# EasyEDA Pro project 后车mainboard_V2.1.epro

# Schematic mainboard_V2.1
Board Name: mainboard_V2.1; Create Date: 2025-02-20; Page Name: P1; Project Name: 主板（后车）; Schematic Name: mainboard_V2.1; Update Date: 2025-02-20; Company: 嘉立创EDA; Page Size: A4; Version: V1.0
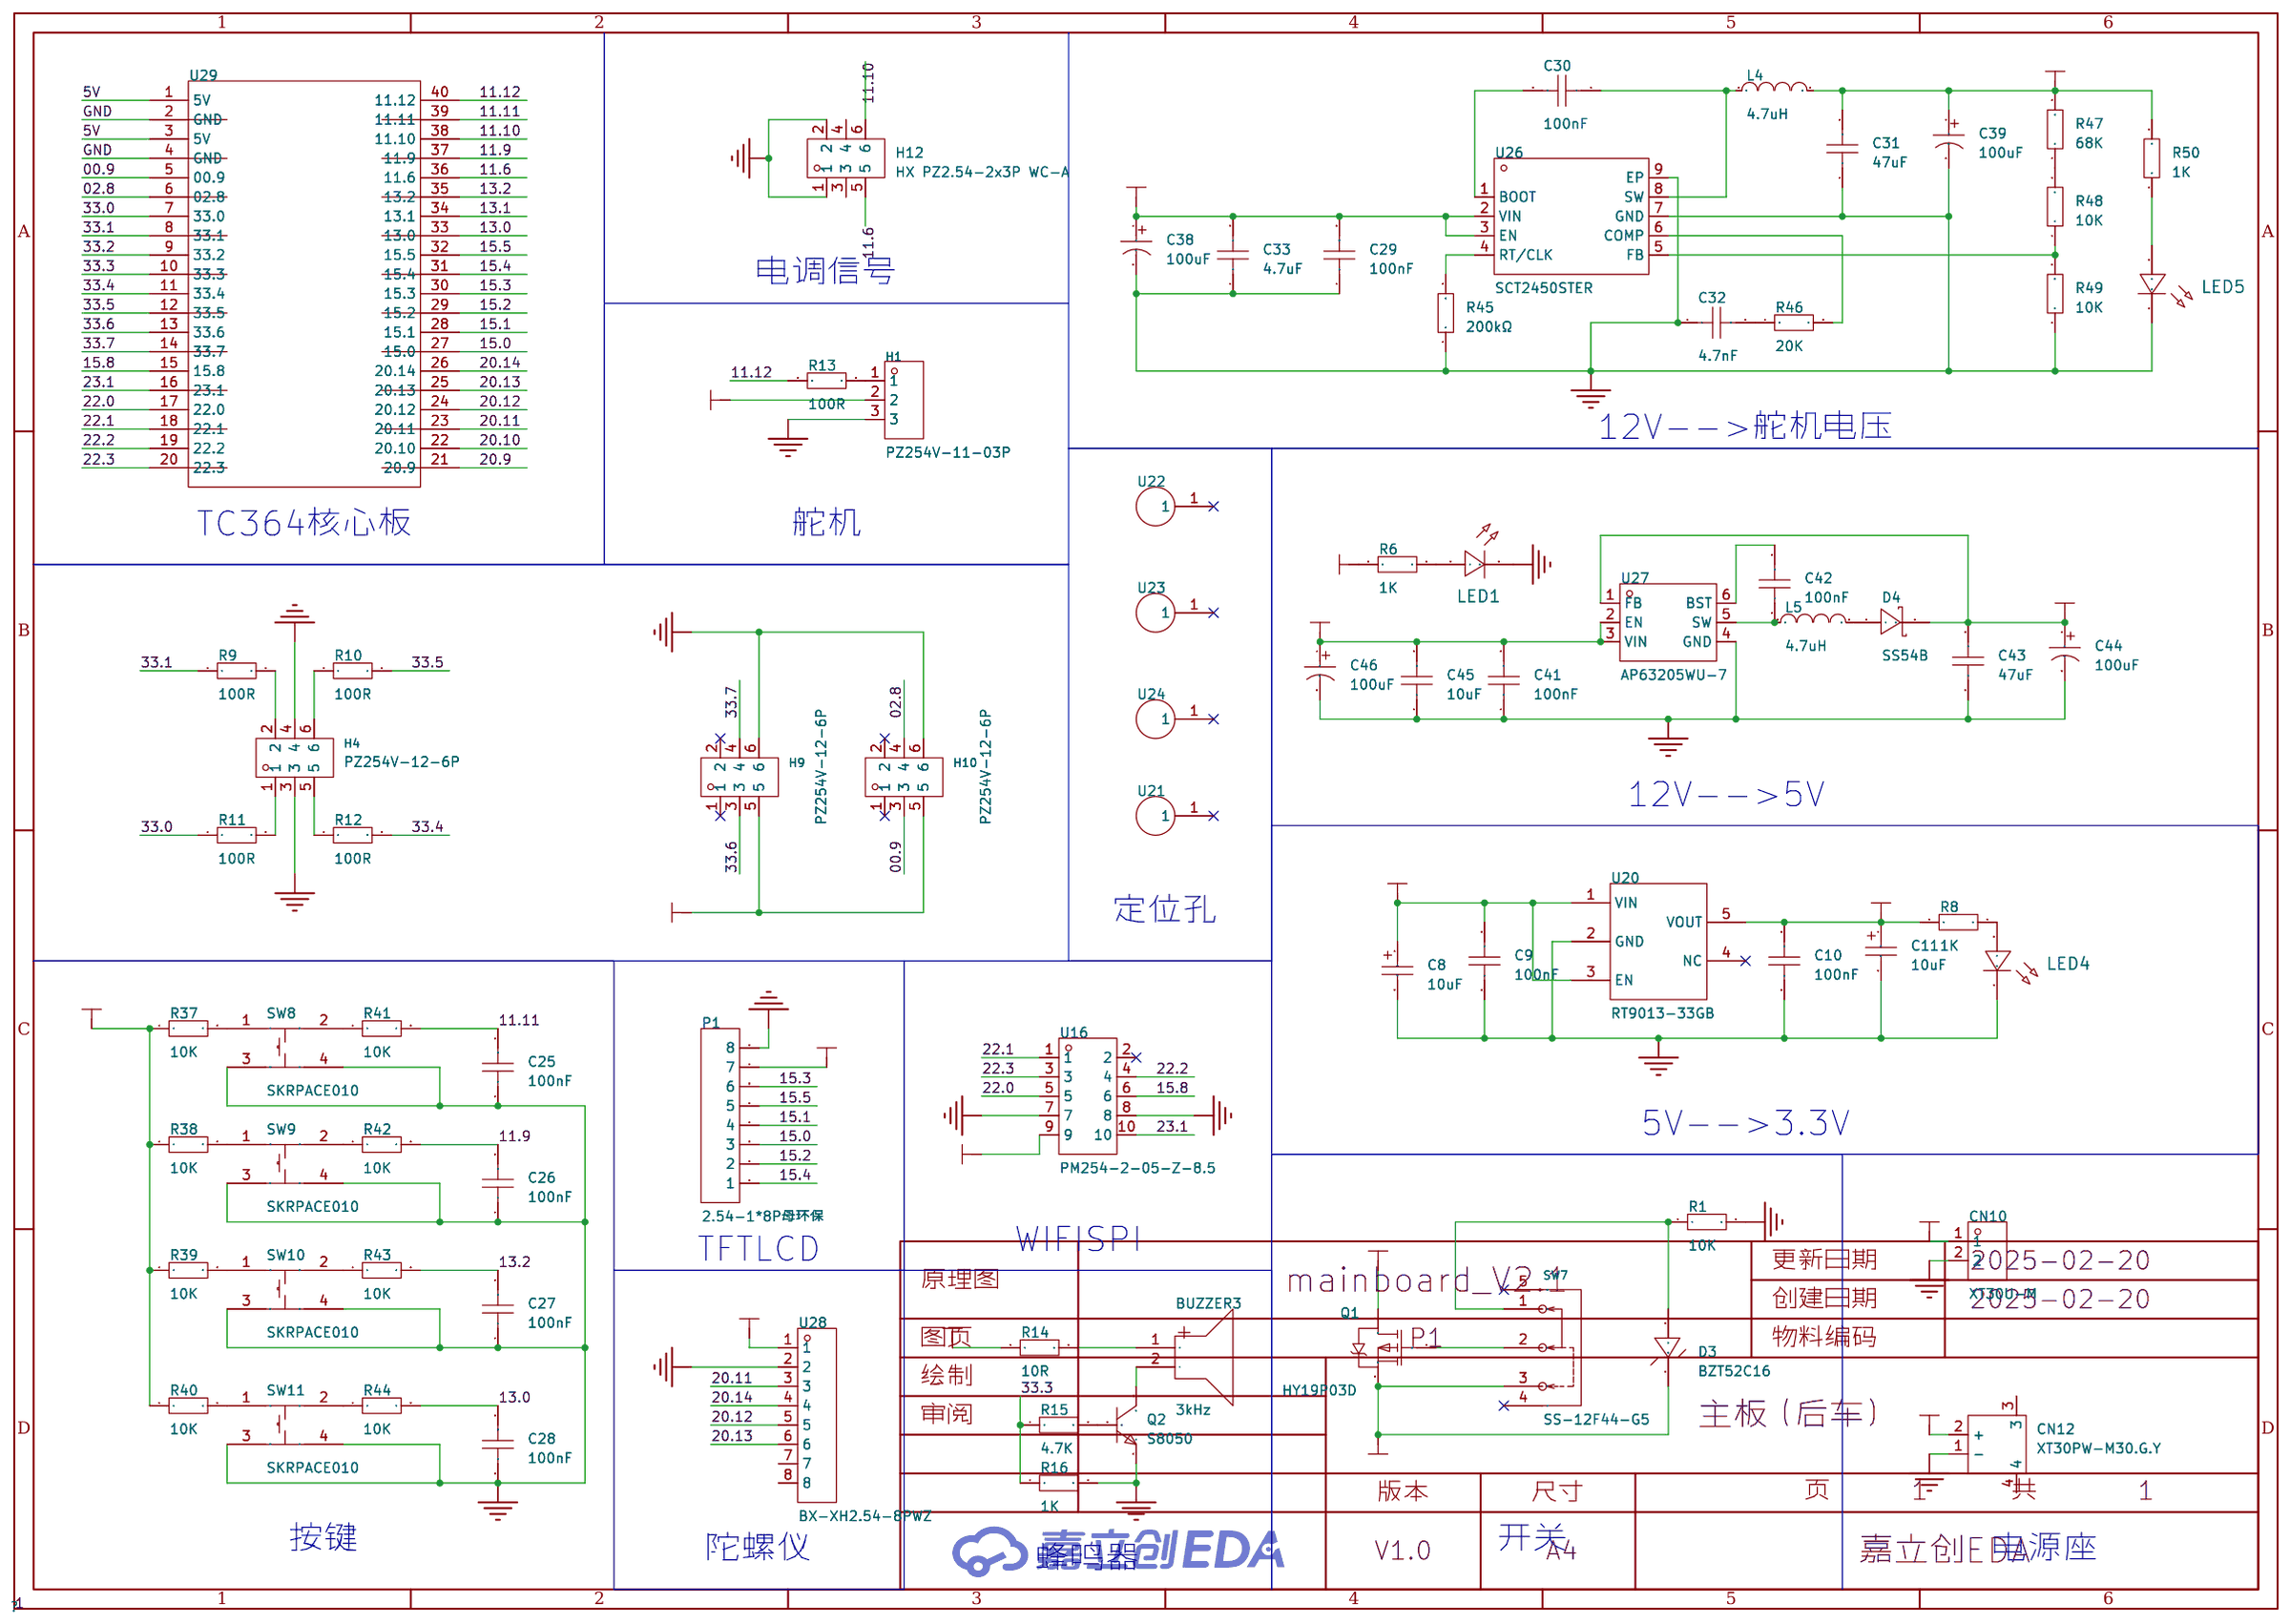
[diagram p0: schematic sheet]

## Parts
BUZZER3  3kHz  [BUZ-TH_BD9.0-P5.00-D0.6-FD]
C8  10uF  [CAP-SMD_L3.2-W1.6-RD-C7171]
C9  100nF  [C0603]
C10  100nF  [C0603]
C11  10uF  [CAP-SMD_L3.2-W1.6-RD-C7171]
C25  100nF  [C0603]
C26  100nF  [C0603]
C27  100nF  [C0603]
C28  100nF  [C0603]
C29  100nF  [C0603]
C30  100nF  [C0603]
C31  47uF  [C0805]
C32  4.7nF  [C0603]
C33  4.7uF  [C0603]
C38  100uF  [CAP-TH_BD6.3-P2.50-D1.0-FD]
C39  100uF  [CAP-TH_BD6.3-P2.50-D1.0-FD]
C41  100nF  [C0603]
C42  100nF  [C0603]
C43  47uF  [C0805]
C44  100uF  [CAP-TH_BD6.3-P2.50-D1.0-FD]
C45  10uF  [C0603]
C46  100uF  [CAP-TH_BD6.3-P2.50-D1.0-FD]
CN10  XT30U-M  [CONN-TH_XT30U-M]
CN12  XT30PW-M30.G.Y  [CONN-TH_XT30PW-M]
D3  BZT52C16  [SOD-123_L2.7-W1.6-LS3.7-RD]
D4  SS54B  [SMB_L4.6-W3.6-LS5.3-RD]
H1  PZ254V-11-03P  [HDR-TH_3P-P2.54-V-M]
H4  PZ254V-12-6P  [HDR-TH_6P-P2.54-V-M-R2-C3-S2.54]
H9  PZ254V-12-6P  [HDR-TH_6P-P2.54-V-M-R2-C3-S2.54]
H10  PZ254V-12-6P  [HDR-TH_6P-P2.54-V-M-R2-C3-S2.54]
H12  HX PZ2.54-2x3P WC-A  [HDR-TH_6P-P2.54-H-M-R2-C3-S2.54-W12.9]
L4  4.7uH  [IND-SMD_L7.0-W6.6]
L5  4.7uH  [IND-SMD_L7.0-W6.6]
LED1  -  [LED_0603]
LED4  -  [LED_0603]
LED5  -  [LED_0603]
P1  2.54-1*8P母环保  [HDR-TH_8P-P2.54-V-F-1]
Q1  HY19P03D  [TO-252-2_L6.6-W6.1-P4.57-LS9.9-TL-CW]
Q2  S8050  [SOT-23-3_L2.9-W1.3-P1.90-LS2.4-BR]
R1  10K  [R0603]
R6  1K  [R0603]
R8  1K  [R0603]
R9  100R  [R0603]
R10  100R  [R0603]
R11  100R  [R0603]
R12  100R  [R0603]
R13  100R  [R0603]
R14  10R  [R0603]
R15  4.7K  [R0603]
R16  1K  [R0603]
R37  10K  [R0603]
R38  10K  [R0603]
R39  10K  [R0603]
R40  10K  [R0603]
R41  10K  [R0603]
R42  10K  [R0603]
R43  10K  [R0603]
R44  10K  [R0603]
R45  200kΩ  [R0603]
R46  20K  [R0603]
R47  68K  [R0603]
R48  10K  [R0603]
R49  10K  [R0603]
R50  1K  [R0603]
SW7  SS-12F44-G5  [SW-TH_SS-12F44-G5]
SW8  SKRPACE010  [KEY-SMD_4P-L4.2-W3.2-P2.20-LS4.6]
SW9  SKRPACE010  [KEY-SMD_4P-L4.2-W3.2-P2.20-LS4.6]
SW10  SKRPACE010  [KEY-SMD_4P-L4.2-W3.2-P2.20-LS4.6]
SW11  SKRPACE010  [KEY-SMD_4P-L4.2-W3.2-P2.20-LS4.6]
U16  PM254-2-05-Z-8.5  [HDR-TH_10P-P2.54-V-F-R2-C5-S2.54]
U20  RT9013-33GB  [SOT-23-5_L3.0-W1.7-P0.95-LS2.8-BL]
U21  -  [M3螺丝孔]  (no BOM)
U22  -  [M3螺丝孔]  (no BOM)
U23  -  [M3螺丝孔]  (no BOM)
U24  -  [M3螺丝孔]  (no BOM)
U26  SCT2450STER  [ESOP-8_L4.9-W3.9-P1.27-LS6.0-BL-EP]
U27  AP63205WU-7  [TSOT-23-6_L2.9-W1.6-P0.95-LS2.8-BL]
U28  BX-XH2.54-8PWZ  [CONN-TH_8P-P2.50_BX-XH2.54-8PWZ]
U29  -  [TC364_CoreBoard_V3.0]

## Library data of the parts
BUZZER3 = HNB09A03: 驱动方式:有源(内含驱动线路);构造类型:电磁式;频率:3kHz;声压(SPL):85dB@10cm;; LCSC Part Name: 电磁式有源一体蜂鸣器HNB09A03; Supplier Part: C96102; Manufacturer: 华能; Supplier Footprint: 插件,D=9mm; JLCPCB Part Class: 扩展库; Datasheet: https://atta.szlcsc.com/upload/public/pdf/source/20170522/1495448326172.pdf; Supplier: LCSC; Oscillator Circuit: 有源(内含驱动线路); Technology Type: 电磁式; Operating Voltage: 1.5V~4.5V; Current Consumption: 30mA; Sound Pressure Level (SPL): 85dB@10cm; Diameter (φD): 9mm; Height: 5.5mm; Operating Temperature: -20℃~+70℃
C8 C11 = TAJA106K016RNJ: 容值:10uF;精度:±10%;额定电压:16V;等效串联电阻:3Ω@100kHz;; LCSC Part Name: 10uF ±10% 16V; Supplier Part: C7171; Manufacturer: Kyocera AVX; Supplier Footprint: CASE-A-3216; JLCPCB Part Class: 基础库; Datasheet: https://atta.szlcsc.com/upload/public/pdf/source/20160107/1457707750344.pdf; Supplier: LCSC; Tolerance: ±10%; Rated Voltage: 16V; Equivalent Series Resistance(ESR): 3Ω@100kHz; Operating Temperature: -55℃~+125℃
C9 C10 C29 C30 = CC0603KRX7R9BB104: 容值:100nF;精度:±10%;额定电压:50V;材质(温度系数):X7R;; LCSC Part Name: 100nF ±10% 50V; Supplier Part: C14663; Manufacturer: YAGEO(国巨); Supplier Footprint: 0603; JLCPCB Part Class: 基础库; Datasheet: https://atta.szlcsc.com/upload/public/pdf/source/20180910/C282072_33301C7F631E79921B82A8DAC6BCC5B3.pdf; Supplier: LCSC; Tolerance: ±10%; Voltage Rated: 50V; Temperature Coefficient: X7R
C25-C28 C32 C33 C41 C42 C45 = CAP_0603: Supplier Footprint: 0603
C31 C43 = CGA0805X5R476M100MT: 容值:47uF;精度:±20%;额定电压:10V;材质(温度系数):X5R;; LCSC Part Name: 47uF ±20% 10V; Supplier Part: C6119904; Manufacturer: HRE(芯声); Supplier Footprint: 0805; JLCPCB Part Class: 扩展库; Supplier: LCSC; Tolerance: ±20%; Voltage Rated: 10V; Temperature Coefficient: X5R
C38 C39 C44 C46 = SPZ1VM101E08O00RAXXX: 容值:100uF;精度:±20%;额定电压:35V;纹波电流:2.35A@100kHz;等效串联电阻:50mΩ@100kHz;类型:-;; LCSC Part Name: 100uF ±20% 35V; Supplier Part: C122240; Manufacturer: AISHI(艾华集团); Supplier Footprint: 插件,D6.3xL8mm; JLCPCB Part Class: 扩展库; Datasheet: https://atta.szlcsc.com/upload/public/pdf/source/20170721/C122240_1500619276730834029.pdf; Supplier: LCSC; Tolerance: ±20%; Rated Voltage: 35V; Ripple Current: 2.35A@100kHz; Equivalent Series Resistance(ESR): 50mΩ@100kHz; Lead Spacing: 2.5mm; φD: 6.3mm; L: 8mm; Lifetime @ Temp: 2000hrs@105℃; Operating Temperature: -55℃~+105℃
CN10 = XT30U-M: 类别:-;类型1:-;; LCSC Part Name: AMASS(艾迈斯)轻量版锂电池插头公头 XT30U-M; Supplier Part: C99101; Manufacturer: AMASS(艾迈斯); JLCPCB Part Class: 扩展库; Datasheet: https://atta.szlcsc.com/upload/public/pdf/source/20170606/1496716542582.pdf; Supplier: LCSC; Brand: 艾迈斯; Type: 插头; Colour: 黄色; InterfaceType: 公头
CN12 = XT30PW-M30.G.Y: 类别:-;类型1:-;; LCSC Part Name: AMASS(艾迈斯)航模插头 卧式弯脚 XT30PW-M公头; Supplier Part: C431092; Manufacturer: AMASS(艾迈斯); JLCPCB Part Class: Extended Part; Datasheet: https://atta.szlcsc.com/upload/public/pdf/source/20220222/6A9F22F7850E25B33E1BE430ADF8560B.pdf; Supplier: LCSC; Type: 航模插头; RatedVoltage: DC 500V; InterfaceType: 公头; RatedCurrent: 15A; RecommendedWireGauge: 16/18/20AWG; contact resistance: 1.2mΩ; specifications: 2pin
D3 = BZT52C16_C266570: 二极管配置:独立式;稳压值(标称值):16V;稳压值(范围):15.3V~17.1V;功率:500mW;精度:-;; Supplier Part: C266570; Manufacturer: BORN(伯恩半导体); Supplier Footprint: SOD-123; JLCPCB Part Class: 扩展库; Datasheet: https://atta.szlcsc.com/upload/public/pdf/source/20180820/C271262_D2D0F24DD5A81EAE2A6B8B493A94E64A.pdf; Supplier: LCSC; Diode Configuration: 独立式; Zener Voltage (Nom): 16V; Reverse Leakage Current (Ir): 100nA@11.2V; Zener Voltage (Range): 15.3V~17.1V; Power Dissipation: 500mW; Zener Impedance (Zzt): 40Ω
D4 = SS54B_C32513: 二极管配置:独立式;正向压降(Vf):550mV@5A;直流反向耐压(Vr):40V;整流电流:5A;; LCSC Part Name: 电压:40V 电流:5A; Supplier Part: C32513; Manufacturer: MDD(辰达半导体); Supplier Footprint: SMB(DO-214AA); JLCPCB Part Class: 扩展库; Datasheet: https://atta.szlcsc.com/upload/public/pdf/source/20240729/11D094B8AB06134CE012673FC230C171.pdf; Supplier: LCSC; Diode Configuration: 独立式; Forward Voltage (Vf@If): 550mV@5A; Reverse Voltage (Vr): 40V; Rectified Current: 5A; Reverse Leakage Current (Ir): 1mA@40V
H1 = PZ254V-11-03P: 排数:单排;总PIN位数:3;间距:2.54mm;插针结构:1x3P;行距:-;安装类型:直插;圆针/方针:方针;额定电流:3A;额定电压:250V;配合针长度:6mm;塑高:2.5mm;端接针长度:3mm;工作温度范围:-40℃~+105℃;颜色:黑色;; LCSC Part Name: 2.54mm 1x3P 直插 方针; Supplier Part: C2937625; Manufacturer: XFCN(兴飞); Supplier Footprint: 直插,P=2.54mm; JLCPCB Part Class: 扩展库; Datasheet: 2022-07-12/581362A/62b9d00620994b3696be7eb4af85ad72/双排排针和单排排针.pdf; Supplier: LCSC; Number of Rows: 单排; Number of Pins: 3; Pitch: 2.54mm; Pin Structure: 1x3P; Mounting Type: 直插; Circluar Pins/Square Pins: 方针; Current Rating (Max): 3A; Voltage Rating (Max): 250V; Length of Mating Pin: 6mm; Insulation Height: 2.5mm; Length of End Connection Pin: 3mm; Operating Temperature Range: -40℃~+105℃; Color: 黑色
H4 H9 H10 = PZ254V-12-6P: 排数:双排;总PIN位数:6P;间距:2.54mm;插针结构:2x3P;行距:2.54mm;安装类型:直插;圆针/方针:方针;额定电流:-;额定电压:-;配合针长度:6mm;塑高:2.5mm;端接针长度:3mm;触头材质:黄铜;触头镀层:-;工作温度范围:-40℃~+105℃;颜色:黑色;; LCSC Part Name: 2.54mm 2x3P 直插 方针; Supplier Part: C492420; Manufacturer: XFCN(兴飞); Supplier Footprint: 插件,P=2.54mm; JLCPCB Part Class: Extended Part; Datasheet: https://atta.szlcsc.com/upload/public/pdf/source/20200309/C492420_BAECB307B001054C09D200388220EAE6.pdf; Supplier: LCSC; Number of Rows: 双排; Number of Pins: 6P; Pitch: 2.54mm; Pin Structure: 2x3P; Row Spacing: 2.54mm; Mounting Type: 直插; Circluar Pins/Square Pins: 方针; Length of Mating Pin: 6mm; Insulation Height: 2.5mm; Length of End Connection Pin: 3mm; Contact Material: 黄铜; Operating Temperature Range: -40℃~+105℃; Color: 黑色
H12 = HX PZ2.54-2x3P WC-A: 插针结构:2x3P;间距:2.54mm;行距:2.54mm;圆针/方针:方针;安装类型:弯插;排数:双排;总PIN位数:6P;额定电流:3A;额定电压:-;配合针长度:6mm;塑高:2.5mm;端接针长度:3mm;触头镀层:金;工作温度范围:-40℃~+105℃;颜色:黑色;; LCSC Part Name: 2x3P 间距:2.54mm 方针 弯插; Supplier Part: C41417351; Manufacturer: hanxia(韩下); Supplier Footprint: 弯插,P=2.54mm; JLCPCB Part Class: 扩展库; Datasheet: https://atta.szlcsc.com/upload/public/pdf/source/20240927/53A3651CA0598B6B3668AB41F5C39B0F.pdf; Supplier: LCSC; Pin Structure: 2x3P; Pitch: 2.54mm; Row Spacing: 2.54mm; Circluar Pins/Square Pins: 方针; Mounting Type: 弯插; Number of Rows: 双排; Number of Pins: 6P; Current Rating (Max): 3A; Length of Mating Pin: 6mm; Insulation Height: 2.5mm; Length of End Connection Pin: 3mm; Contact Plating: 金; Operating Temperature Range: -40℃~+105℃; Color: 黑色
L4 L5 = FXL0630-4R7-M: 电感值:4.7uH;精度:±20%;额定电流:6A;饱和电流(Isat):9A;类型:一体成型电感;; LCSC Part Name: 4.7uH ±20% 9A; Supplier Part: C167220; Manufacturer: cjiang(长江微电); Supplier Footprint: SMD,6.6x7mm; JLCPCB Part Class: 扩展库; Datasheet: https://atta.szlcsc.com/upload/public/pdf/source/20240426/3189EA8206330E2108542F9E34E540E7.pdf; Supplier: LCSC; Tolerance: ±20%; Rated Current: 6A; Saturation Current (Isat): 9A; DC Resistance (DCR): 33mΩ; Type: 一体成型电感
LED1 LED4 LED5 = LED_0603-R: Supplier Footprint: 0603
P1 = 2.54-1*8P母环保: 插孔结构:1x8P;间距:2.54mm;行距:-;安装类型:直插;排数:单排;总孔位数:8P;塑高:-;触头材质:-;触头镀层:-;; LCSC Part Name: 间距:2.54mm 1x8P 直插; Supplier Part: C27438; Manufacturer: BOOMELE(博穆精密); Supplier Footprint: 插件,P=2.54mm; JLCPCB Part Class: Extended Part; Datasheet: https://atta.szlcsc.com/upload/public/pdf/source/20231221/1CA800C6799ED97958773716FAA1BFFE.pdf; Supplier: LCSC; Holes Structure: 1x8P; Pitch: 2.54mm; Mounting Type: 直插; Number of Rows: 单排; Number of Holes: 8P
Q1 = HY19P03D: 类型:P沟道;漏源电压(Vdss):30V;连续漏极电流(Id):90A;功率(Pd):50W;导通电阻(RDS(on)@Vgs,Id):6mΩ@10V,45A;阈值电压(Vgs(th)@Id):3V@250uA;; LCSC Part Name: P沟道 30V 90A; Supplier Part: C122492; Manufacturer: HUAYI(华羿微); Supplier Footprint: TO-252-2; JLCPCB Part Class: 扩展库; Datasheet: https://atta.szlcsc.com/upload/public/pdf/source/20170728/C122492_1501225751911848809.pdf; Supplier: LCSC; Type: P沟道; Drain Source Voltage (Vdss): 30V; Continuous Drain Current (Id): 90A; Power Dissipation (Pd): 50W; Drain Source On Resistance (RDS(on)@Vgs,Id): 6mΩ@10V,45A; Gate Threshold Voltage (Vgs(th)@Id): 3V@250uA
Q2 = S8050_C2891804: 晶体管类型:NPN;集电极电流(Ic):500mA;集射极击穿电压(Vceo):25V;功率(Pd):300mW;; LCSC Part Name: 耐压:25V 电流:500mA NPN; Supplier Part: C2891804; Manufacturer: YONGYUTAI(永裕泰); Supplier Footprint: SOT-23; JLCPCB Part Class: 扩展库; Datasheet: https://atta.szlcsc.com/upload/public/pdf/source/20210901/5347316A10609C628D4D69AE01446E5B.pdf; Supplier: LCSC; Transistor Type: NPN; Collector Current (Ic): 500mA; Collector-Emitter Breakdown Voltage (Vceo): 25V; Power Dissipation (Pd): 300mW; Collector Cut-Off Current (Icbo): 1uA; Collector-Emitter Saturation Voltage (VCE(sat)@Ic,Ib): 500mV@500mA,50mA; Operating Temperature: +150℃@(Tj)
R1 R6 R8-R16 R37-R44 R46-R50 = Res_0603: Supplier Footprint: 0603
R45 = 0603WAF2003T5E: 电阻类型:厚膜电阻;阻值:200kΩ;精度:±1%;功率:100mW;最大工作电压:75V;温度系数:±100ppm/℃;; LCSC Part Name: 200kΩ ±1% 100mW 厚膜电阻; Supplier Part: C25811; Manufacturer: UNI-ROYAL(厚声); Supplier Footprint: 0603; JLCPCB Part Class: 基础库; Datasheet: https://atta.szlcsc.com/upload/public/pdf/source/20200306/C422600_1E6D84923E4A46A82E41ADD87F860B5C.pdf; Supplier: LCSC; Type: 厚膜电阻; Tolerance: ±1%; Power(Watts): 100mW; Overload Voltage (Max): 75V; Temperature Coefficient: ±100ppm/℃; Operating Temperature Range: -55℃~+155℃
SW7 = SS-12F44-G5_C136718: 额定电流(DC):-;额定电压(DC):-;额定电流(AC):-;额定电压(AC):-;电路结构:单刀双掷;安装方式:直插;机械寿命:5千次;; LCSC Part Name: 直插双档 滑动开关; Supplier Part: C136718; Manufacturer: 韩国韩荣; Supplier Footprint: 插件; JLCPCB Part Class: 扩展库; Datasheet: https://atta.szlcsc.com/upload/public/pdf/source/20171123/C136718_15114108132111137440.pdf; Supplier: LCSC; Circuit: 单刀双掷; Mounting Style: 直插; Mechanical Life: 5千次; Actuator Style: 矩形柱状; Pin Style: PC引脚; Operating Temperature: -25℃~+70℃; Switch Height: 11mm
SW8-SW11 = SKRPACE010: 电路结构:单刀单掷;按钮形状:椭圆形按钮;安装方式:立贴;开关长度:4.2mm;开关宽度:3.2mm;开关高度:2.5mm;触点电流:50mA;额定电压(DC):16V;带灯:-;机械寿命:-;; LCSC Part Name: 4.2*3.2*2.5mm 立贴 轻触开关; Supplier Part: C139797; Manufacturer: ALPSALPINE(阿尔卑斯阿尔派); Supplier Footprint: SMD; JLCPCB Part Class: 扩展库; Datasheet: https://atta.szlcsc.com/upload/public/pdf/source/20171113/C139797_15105612676371115729.pdf; Supplier: LCSC; Circuit: 单刀单掷; Actuator Style: 椭圆形按钮; Mounting Style: 立贴; Switch Length: 4.2mm; Switch Width: 3.2mm; Switch Height: 2.5mm; Contact Current: 50mA; Voltage Rating (DC): 16V
U16 = PM254-2-05-Z-8.5: 排数:双排;总孔位数:10P;间距:2.54mm;插孔结构:2x5P;行距:2.54mm;安装类型:直插;圆孔/方孔:方孔;额定电流:3A;额定电压:-;插孔方向:顶部;塑高:8.5mm;工作温度范围:-40℃~+105℃;; LCSC Part Name: 间距:2.54mm 2x5P 直插; Supplier Part: C2897406; Manufacturer: HCTL(华灿天禄); Supplier Footprint: 插件,P=2.54mm; JLCPCB Part Class: 扩展库; Datasheet: https://atta.szlcsc.com/upload/public/pdf/source/20230609/3D36CA2C1BFC9FD1C3F709AD9DFEB9C2.pdf; Supplier: LCSC; Number of Rows: 双排; Number of Holes: 10P; Pitch: 2.54mm; Holes Structure: 2x5P; Row Spacing: 2.54mm; Mounting Type: 直插; Circular Hole / Square Hole: 方孔; Current Rating (Max): 3A; Holes Direction: 顶部; Insulation Height: 8.5mm; Operating Temperature Range: -40℃~+105℃
U20 = RT9013-33GB: 输出类型:固定;输出极性:正;最大输入电压:5.5V;输出电压:3.3V;输出电流:500mA;电源纹波抑制比(PSRR):50dB@(10kHz);; LCSC Part Name: 输入5.5V 输出3.3V 500mA; Supplier Part: C47773; Manufacturer: RICHTEK(立锜); Supplier Footprint: SOT-23-5; JLCPCB Part Class: 扩展库; Datasheet: https://atta.szlcsc.com/upload/public/pdf/source/20150504/1457707282459.pdf; Supplier: LCSC; Output Type: 固定; Output Polarity: 正; Number of Outputs: 1; Maximum Input Voltage: 5.5V; Output Voltage: 3.3V; Dropout Voltage: 400mV@(500mA); Quiescent Current (Ground Current): 50uA; Output Current: 500mA; Power Supply Rejection Ratio (PSRR): 50dB@(10kHz); Operating Temperature: -40℃~+85℃
U21-U24 = M3螺丝孔
U26 = SCT2450STER: LCSC Part Name: 电源IC; Supplier Part: C509400; Manufacturer: SCT(芯洲科技); Supplier Footprint: ESOP-8; JLCPCB Part Class: 扩展库; Datasheet: https://atta.szlcsc.com/upload/public/pdf/source/20200407/C509400_EDF779A672A59398CFBA9E95FA584FEC.pdf; Supplier: LCSC
U27 = AP63205WU-7: 功能类型:降压型;输出类型:固定;输入电压:3.8V~32V;输出电压:5V;输出电流:2A;; LCSC Part Name: 3.8V至32V输入、2A低静态电流同步降压转换器，增强EMI抑制; Supplier Part: C2071056; Manufacturer: DIODES(美台); Supplier Footprint: TSOT-23-6; JLCPCB Part Class: 扩展库; Datasheet: https://atta.szlcsc.com/upload/public/pdf/source/20210622/C780769_099C67289BD3EC61AAFB52D8B07125B3.pdf; Supplier: LCSC; Function: 降压型; Output Type: 固定; Input Voltage: 3.8V~32V; Output Voltage: 5V; Output Current: 2A; Switching Frequency: 1.1MHz; Operating Temperature: -40℃~+85℃@(TA); Synchronous Rectification: 是; Number of Outputs: 1; Topology: 降压式; Quiescent Current (Iq): 22uA; Switch tube (built-in/external): 内置
U28 = BX-XH2.54-8PWZ: 插针结构:1x8P;间距:2.54mm;安装方式:弯插;参考系列:XH;总PIN数:8P;排数:1;每排PIN数:8;行距:-;额定电流:3A;触头材质:黄铜;触头镀层:锡;工作温度范围:-25℃~+85℃;; LCSC Part Name: 配套胶壳型号：BX-XH2.54-8PJK 配套端子型号：BX-XH2.54-DZ 配套杜邦线型号：BX-XH2.54-8PBXC; Supplier Part: C18077848; Manufacturer: Bossie(博锡); Supplier Footprint: 弯插,P=2.54mm; JLCPCB Part Class: 扩展库; Datasheet: https://atta.szlcsc.com/upload/public/pdf/source/20231017/41AC97E47A986FC17CA1415D1E63C8BA.pdf; Supplier: LCSC; Pins Structure: 1x8P; Pitch: 2.54mm; Mounting Style: 弯插; Reference Series: XH; Number of Pins: 8P; Number of Rows: 1; Number of PINs Per Row: 8; Current Rating (Max): 3A; Contact Material: 黄铜; Contact Plating: 锡; Operating Temperature Range: -25℃~+85℃
U29 = TC364_CoreBoard_V3.0

## Nets
3V3: C10.2 C11.1 H9.5 H10.5 P1.7 R8.2 R14.1 R37.1 R38.1 R39.1 R40.1 U20.5(VOUT) U28.1
5V: C8.1 C9.2 C43.2 C44.1 D4.1(K) R6.2 U16.9 U20.1(VIN) U20.3(EN) U27.1(FB) U29.1(5V) U29.3(5V)
GND: C8.2 C9.1 C10.1 C11.2 C25.1 C26.1 C27.1 C28.1 C29.1 C31.1 C32.1 C33.1 C38.2 C39.2 C41.1 C43.1 C44.2 C45.1 C46.2 CN10.2 CN12.1(-) H1.3 H4.3 H4.4 H9.6 H10.6 H12.1 H12.2 LED1.1(C) LED4.1(C) LED5.1(C) P1.8 Q2.2(E) R1.2 R16.2 R45.1 R49.1 SW8.3 SW8.4 SW9.3 SW9.4 SW10.3 SW10.4 SW11.3 SW11.4 U16.7 U16.8 U20.2(GND) U26.7(GND) U26.9(EP) U27.4(GND) U28.2 U29.2(GND) U29.4(GND)
VCCBAT: C29.2 C33.2 C38.1 C41.2 C45.2 C46.1 CN12.2(+) Q1.2(D) U26.2(VIN) U26.3(EN) U27.2(EN) U27.3(VIN)
VCCSTEER: C31.2 C39.1 H1.2 L4.2 R47.2 R50.2
VIN: CN10.1 D3.1 Q1.3(S) SW7.3
00.9: H10.3 U29.5(00.9)
02.8: H10.4 U29.6(02.8)
11.6: H12.5 U29.36(11.6)
11.9: C26.2 R42.2 U29.37(11.9)
11.10: H12.6 U29.38(11.10)
11.11: C25.2 R41.2 U29.39(11.11)
11.12: R13.1 U29.40(11.12)
13.0: C28.2 R44.2 U29.33(13.0)
13.1: U29.34(13.1)
13.2: C27.2 R43.2 U29.35(13.2)
15.0: P1.3 U29.27(15.0)
15.1: P1.4 U29.28(15.1)
15.2: P1.2 U29.29(15.2)
15.3: P1.6 U29.30(15.3)
15.4: P1.1 U29.31(15.4)
15.5: P1.5 U29.32(15.5)
15.8: U16.6 U29.15(15.8)
20.9: U29.21(20.9)
20.10: U29.22(20.10)
20.11: U28.3 U29.23(20.11)
20.12: U28.5 U29.24(20.12)
20.13: U28.6 U29.25(20.13)
20.14: U28.4 U29.26(20.14)
22.0: U16.5 U29.17(22.0)
22.1: U16.1 U29.18(22.1)
22.2: U16.4 U29.19(22.2)
22.3: U16.3 U29.20(22.3)
23.1: U16.10 U29.16(23.1)
33.0: R11.1 U29.7(33.0)
33.1: R9.1 U29.8(33.1)
33.2: U29.9(33.2)
33.3: R15.1 R16.1 U29.10(33.3)
33.4: R12.2 U29.11(33.4)
33.5: R10.2 U29.12(33.5)
33.6: H9.3 U29.13(33.6)
33.7: H9.4 U29.14(33.7)
$1N756: Q1.1(G) SW7.2
$1N757: D3.2 R1.1 SW7.1
$1N1651: LED1.2(A) R6.1
$1N1936: LED4.2(A) R8.1
$1N2039: H1.1 R13.2
$1N2442: BUZZER3.1(+) R14.2
$1N2446: BUZZER3.2(-) Q2.3(C)
$1N2966: H4.2 R9.2
$1N2968: H4.6 R10.1
$1N2969: H4.1 R11.2
$1N2971: H4.5 R12.1
$1N3489: R37.2 SW8.1
$1N3490: R38.2 SW9.1
$1N3491: R39.2 SW10.1
$1N3492: R40.2 SW11.1
$1N3494: R42.1 SW9.2
$1N3495: R43.1 SW10.2
$1N3496: R44.1 SW11.2
$1N3497: R41.1 SW8.2
$1N3677: Q2.1(B) R15.2
$1N6375: R45.2 U26.4(RT/CLK)
$1N6376: C30.2 U26.1(BOOT)
$1N6377: C30.1 L4.1 U26.8(SW)
$1N6378: R48.1 R49.2 U26.5(FB)
$1N6381: LED5.2(A) R50.1
$1N6382: R46.2 U26.6(COMP)
$1N6384: C32.2 R46.1
$1N6385: R47.1 R48.2
$1N16876: C42.1 L5.1 U27.5(SW)
$1N16880: C42.2 U27.6(BST)
$1N18849: D4.2(A) L5.2

Not connected (* = marked no-connect by the designer): CN12 3 4; H9 1* 2*; H10 1* 2*; H12 3 4; SW7 4* 5*; U16 2*; U20 4(NC)*; U21 1*; U22 1*; U23 1*; U24 1*; U28 7 8

## Notes on the sheet
- 电调信号
- 12V-->舵机电压
- TC364核心板
- 舵机
- 12V-->5V
- 定位孔
- 5V-->3.3V
- TFTLCD
- WIFISPI
- 按键
- 陀螺仪
- 开关
- 电源座
- 蜂鸣器

# Board mainboard_V2.1
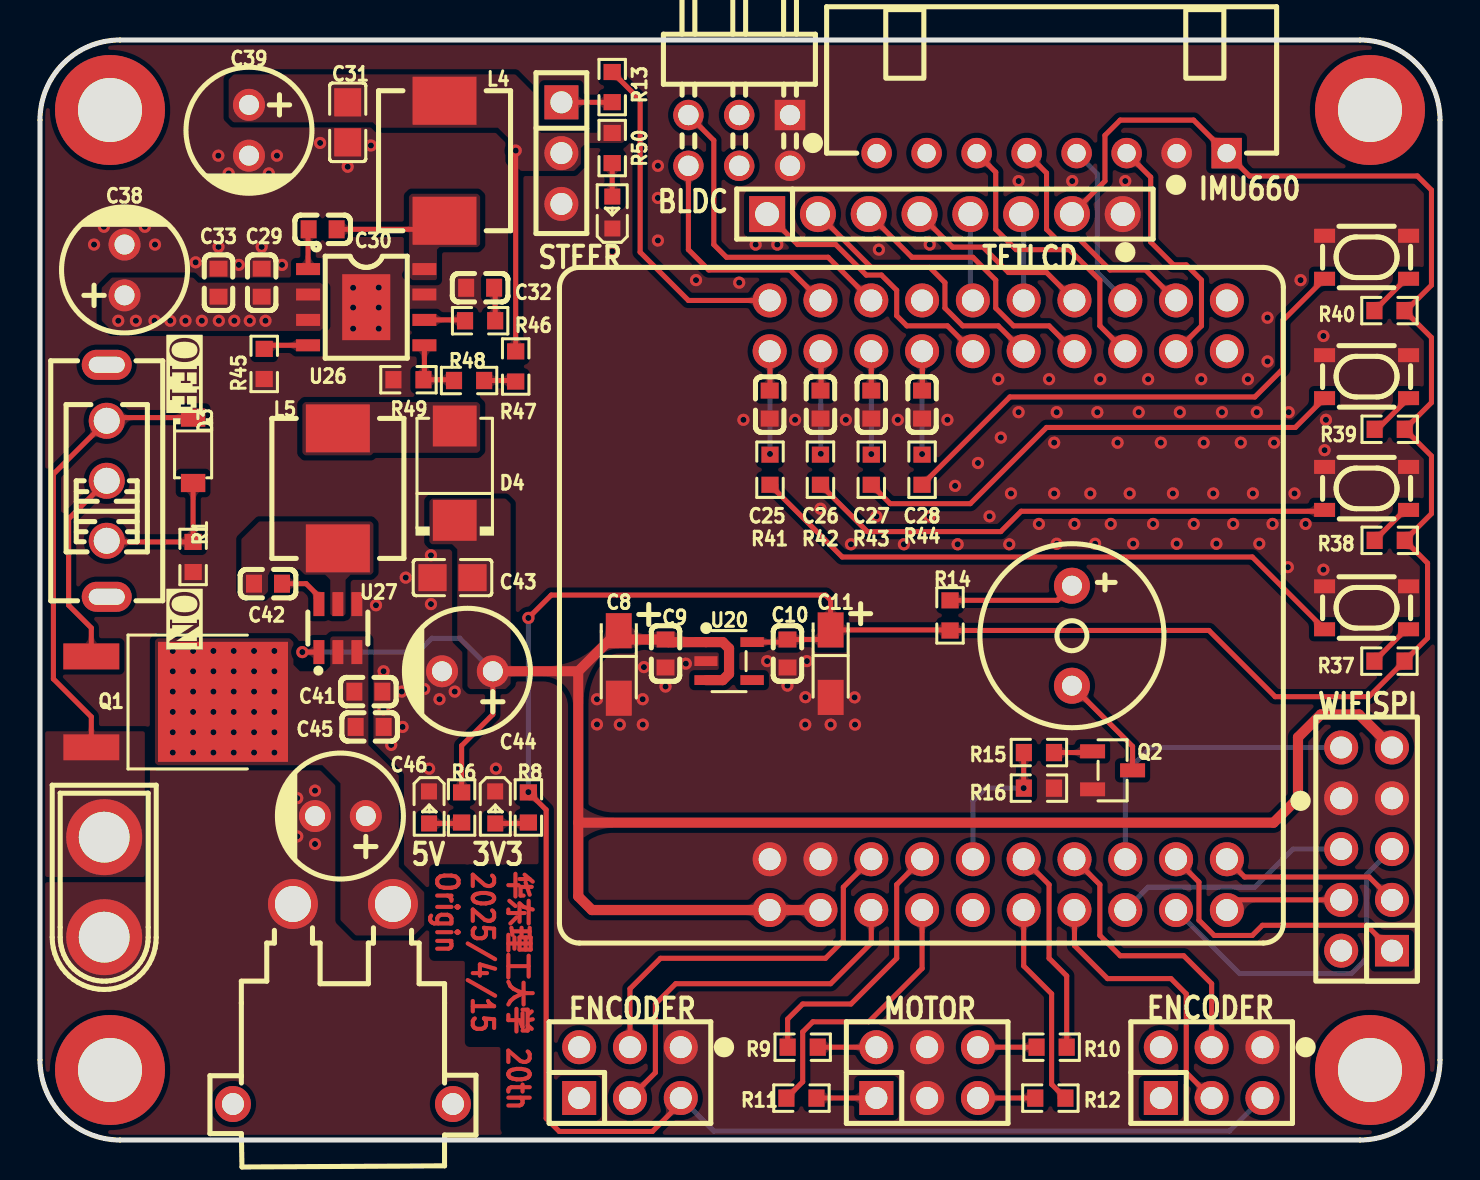
[diagram p1: board, top side]
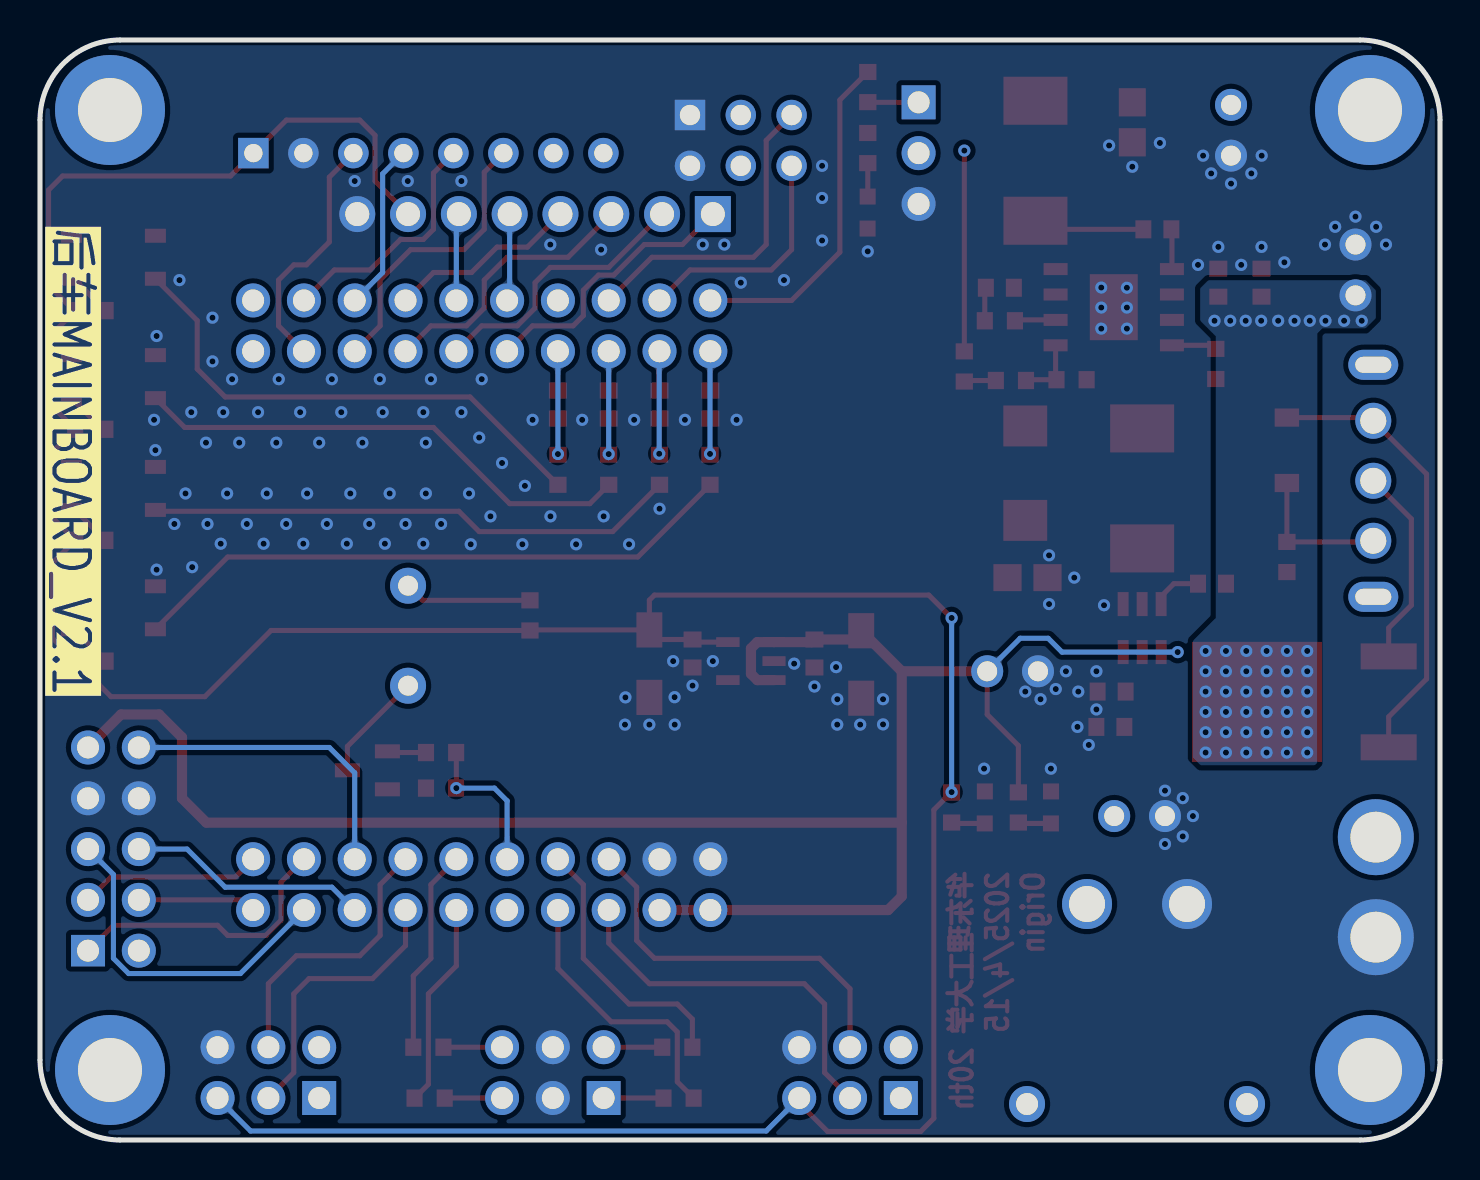
[diagram p2: board, bottom side, seen from below]

Outline 70 x 55 mm; copper layers: Top Layer, Bottom Layer. Coordinates in mm from the lower left corner of the outline.
Outline path: 0,51 0,4 arc(1.17,1.17) 4,0 66,0 arc(68.83,1.17) 70,4 70,51 arc(68.83,53.83) 66,55 4,55 arc(1.17,53.83) 0,51
Stack: Top Layer 0.035mm / Dielectric1 1.51mm FR4 er 4.5 / Bottom Layer 0.035mm

## Design rules (mm)
template: 4层
spacing copperThickness1oz (default): track to track 0.102, other pairs 0.152 to 0.3
spacing copperThickness2oz: track to track 0.203, other pairs 0.152 to 0.3
spacing copperThicknessInner0.5oz: track to track 0.089, other pairs 0.152 to 0.3
track width copperThickness1oz (default): min 0.102, default 0.254, max 2.54
track width copperThickness2oz: min 0.203, default 0.254, max 2.54
track width copperThickness0.5oz: min 0.089, default 0.254, max 2.54
differential pair differentialPair (default): width min 0.127, default 0.254, max 2.54; gap min 0.152, default 0.152
via viaSize (default): diameter min 0.3, default 0.61, max 10; hole min 0.2, default 0.305, max 6.3

## Placement (name value [footprint] x y rotation side)
BUZZER3  3kHz  [BUZ-TH_BD9.0-P5.00-D0.6-FD]  51.6 25.21 270 top
C8  10uF  [CAP-SMD_L3.2-W1.6-RD-C7171]  28.94 23.78 270 top
C9  100nF  [C0603]  31.28 24.33 90 top
C10  100nF  [C0603]  37.37 24.33 90 top
C11  10uF  [CAP-SMD_L3.2-W1.6-RD-C7171]  39.53 23.82 270 top
C25  100nF  [C0603]  36.48 36.77 90 top
C26  100nF  [C0603]  39.02 36.77 90 top
C27  100nF  [C0603]  41.56 36.77 90 top
C28  100nF  [C0603]  44.1 36.77 90 top
C29  100nF  [C0603]  11.08 42.87 270 top
C30  100nF  [C0603]  14.13 45.53 180 top
C31  47uF  [C0805]  15.39 50.88 90 top
C32  4.7nF  [C0603]  22.01 42.61 0 top
C33  4.7uF  [C0603]  8.92 42.87 270 top
C38  100uF  [CAP-TH_BD6.3-P2.50-D1.0-FD]  4.23 43.5 90 top
C39  100uF  [CAP-TH_BD6.3-P2.50-D1.0-FD]  10.45 50.49 270 top
C41  100nF  [C0603]  16.42 22.42 180 top
C42  100nF  [C0603]  11.4 27.82 0 top
C43  47uF  [C0805]  20.62 28.12 0 top
C44  100uF  [CAP-TH_BD6.3-P2.50-D1.0-FD]  21.37 23.44 180 top
C45  10uF  [C0603]  16.48 20.65 180 top
C46  100uF  [CAP-TH_BD6.3-P2.50-D1.0-FD]  15.02 16.2 180 top
CN10  XT30U-M  [CONN-TH_XT30U-M]  3.21 12.64 270 top
CN12  XT30PW-M30.G.Y  [CONN-TH_XT30PW-M]  15.15 6.8 0 top
D3  BZT52C16  [SOD-123_L2.7-W1.6-LS3.7-RD]  7.66 34.48 270 top
D4  SS54B  [SMB_L4.6-W3.6-LS5.3-RD]  20.74 33.34 90 top
H1  PZ254V-11-03P  [HDR-TH_3P-P2.54-V-M]  26.07 49.34 270 top
H4  PZ254V-12-6P  [HDR-TH_6P-P2.54-V-M-R2-C3-S2.54]  44.36 3.37 0 top
H9  PZ254V-12-6P  [HDR-TH_6P-P2.54-V-M-R2-C3-S2.54]  58.58 3.37 0 top
H10  PZ254V-12-6P  [HDR-TH_6P-P2.54-V-M-R2-C3-S2.54]  29.5 3.37 0 top
H12  HX PZ2.54-2x3P WC-A  [HDR-TH_6P-P2.54-H-M-R2-C3-S2.54-W12.9]  34.96 49.98 180 top
L4  4.7uH  [IND-SMD_L7.0-W6.6]  20.23 48.96 90 top
L5  4.7uH  [IND-SMD_L7.0-W6.6]  14.89 32.58 90 top
LED1  -  [LED_0603]  19.46 16.58 270 top
LED4  -  [LED_0603]  22.77 16.58 270 top
LED5  -  [LED_0603]  28.61 46.42 90 top
P1  2.54-1*8P母环保  [HDR-TH_8P-P2.54-V-F-1]  45.25 46.3 0 top
Q1  HY19P03D  [TO-252-2_L6.6-W6.1-P4.57-LS9.9-TL-CW]  5.86 21.91 0 top
Q2  S8050  [SOT-23-3_L2.9-W1.3-P1.90-LS2.4-BR]  53.63 18.48 180 top
R1  10K  [R0603]  7.66 29.15 270 top
R6  1K  [R0603]  21.08 16.63 90 top
R8  1K  [R0603]  24.42 16.63 90 top
R9  100R  [R0603]  38.13 4.64 0 top
R10  100R  [R0603]  50.58 4.64 0 top
R11  100R  [R0603]  38.07 2.09 0 top
R12  100R  [R0603]  50.52 2.09 0 top
R13  100R  [R0603]  28.61 52.65 270 top
R14  10R  [R0603]  45.5 26.23 90 top
R15  4.7K  [R0603]  49.95 19.37 0 top
R16  1K  [R0603]  49.95 17.59 0 top
R37  10K  [R0603]  67.47 23.94 180 top
R38  10K  [R0603]  67.49 29.98 180 top
R39  10K  [R0603]  67.49 35.54 180 top
R40  10K  [R0603]  67.47 41.47 180 top
R41  10K  [R0603]  36.5 33.51 90 top
R42  10K  [R0603]  39.02 33.51 90 top
R43  10K  [R0603]  41.56 33.51 90 top
R44  10K  [R0603]  44.1 33.51 90 top
R45  200kΩ  [R0603]  11.21 38.8 90 top
R46  20K  [R0603]  22.01 40.96 180 top
R47  68K  [R0603]  23.78 38.68 90 top
R48  10K  [R0603]  21.45 37.97 0 top
R49  10K  [R0603]  18.42 38.01 0 top
R50  1K  [R0603]  28.61 49.6 90 top
SW7  SS-12F44-G5  [SW-TH_SS-12F44-G5]  3.34 32.96 90 top
SW8  SKRPACE010  [KEY-SMD_4P-L4.2-W3.2-P2.20-LS4.6]  66.33 26.61 180 top
SW9  SKRPACE010  [KEY-SMD_4P-L4.2-W3.2-P2.20-LS4.6]  66.33 32.58 180 top
SW10  SKRPACE010  [KEY-SMD_4P-L4.2-W3.2-P2.20-LS4.6]  66.33 38.17 180 top
SW11  SKRPACE010  [KEY-SMD_4P-L4.2-W3.2-P2.20-LS4.6]  66.33 44.14 180 top
U16  PM254-2-05-Z-8.5  [HDR-TH_10P-P2.54-V-F-R2-C5-S2.54]  66.33 14.55 90 top
U20  RT9013-33GB  [SOT-23-5_L3.0-W1.7-P0.95-LS2.8-BL]  34.45 23.94 270 top
U21  -  [M3螺丝孔]  66.5 51.5 0 top
U22  -  [M3螺丝孔]  3.5 3.5 0 top
U23  -  [M3螺丝孔]  3.5 51.5 0 top
U24  -  [M3螺丝孔]  66.5 3.5 0 top
U26  SCT2450STER  [ESOP-8_L4.9-W3.9-P1.27-LS6.0-BL-EP]  16.31 41.64 270 top
U27  AP63205WU-7  [TSOT-23-6_L2.9-W1.6-P0.95-LS2.8-BL]  14.89 25.59 0 top
U28  BX-XH2.54-8PWZ  [CONN-TH_8P-P2.50_BX-XH2.54-8PWZ]  50.58 49.34 180 top
U29  -  [TC364_CoreBoard_V3.0]  45.12 26.74 90 top

## Footprints (pads in the part's own frame, mm; a bottom-side part is the same pattern mirrored in y, then rotated)
BUZ-TH_BD9.0-P5.00-D0.6-FD
  round 1.8 hole 1: 1(-2.5,0) 2(2.5,0)
C0603
  rect 0.8x0.9 smd: 1(-0.7,0) 2(0.7,0)
C0805
  rect 1.41x1.35 smd: 1(-1,0) 2(1,0)
CAP-SMD_L3.2-W1.6-RD-C7171
  rect 1.758x1.296 smd: 1(-1.687,0) 2(1.687,0)
CAP-TH_BD6.3-P2.50-D1.0-FD
  round 1.6 hole 1: 1(-1.27,0) 2(1.27,0)
CONN-TH_8P-P2.50_BX-XH2.54-8PWZ
  rect 1.524x1.524 hole 0.914: 1(-8.75,0)
  round 1.524 hole 0.914: 2(-6.25,0) 3(-3.75,0) 4(-1.25,0) 5(1.25,0) 6(3.75,0) 7(6.25,0) 8(8.75,0)
CONN-TH_XT30PW-M
  round 2.5 hole 1.8: 1(-2.5,5) 2(2.5,5)
  round 1.8 hole 1.1: 3(5.5,-5) 4(-5.5,-5)
CONN-TH_XT30U-M
  round 3.8 hole 2.54: 1(-2.5,0) 2(2.5,0)
ESOP-8_L4.9-W3.9-P1.27-LS6.0-BL-EP
  rect 0.6x1.2 smd: 1(-1.905,-2.909) 2(-0.635,-2.909) 3(0.635,-2.909) 4(1.905,-2.909) 5(1.905,2.909) 6(0.635,2.909) 7(-0.635,2.909) 8(-1.905,2.909)
  rect 3.3x2.4 smd: 9(0,0)
HDR-TH_3P-P2.54-V-M
  rect 1.7x1.7 hole 1.1: 1(-2.54,0)
  round 1.7 hole 1.1: 2(0,0) 3(2.54,0)
HDR-TH_6P-P2.54-H-M-R2-C3-S2.54-W12.9
  rect 1.52x1.52 hole 1.02: 1(-2.54,-1.27)
  round 1.52 hole 1.02: 2(-2.54,1.27) 3(0,-1.27) 4(0,1.27) 5(2.54,-1.27) 6(2.54,1.27)
HDR-TH_6P-P2.54-V-M-R2-C3-S2.54
  rect 1.7x1.7 hole 1.1: 1(-2.54,-1.27)
  round 1.7 hole 1.1: 2(-2.54,1.27) 3(0,-1.27) 4(0,1.27) 5(2.54,-1.27) 6(2.54,1.27)
HDR-TH_8P-P2.54-V-F-1
  rect 1.8x1.8 hole 1.2: 1(-8.89,0)
  round 1.8 hole 1.2: 2(-6.35,0) 3(-3.81,0) 4(-1.27,0) 5(1.27,0) 6(3.81,0) 7(6.35,0) 8(8.89,0)
HDR-TH_10P-P2.54-V-F-R2-C5-S2.54
  rect 1.575x1.7 hole 1.1: 1(-5.08,-1.27)
  round 1.7 hole 1.1: 2(-5.08,1.27) 3(-2.54,-1.27) 4(-2.54,1.27) 5(0,-1.27) 6(0,1.27) 7(2.54,-1.27) 8(2.54,1.27) 9(5.08,-1.27) 10(5.08,1.27)
IND-SMD_L7.0-W6.6
  rect 2.4x3.2 smd: 1(-3,0) 2(3,0)
KEY-SMD_4P-L4.2-W3.2-P2.20-LS4.6
  rect 1.05x0.7 smd: 1(-2.1,1.075) 2(2.1,1.075) 3(-2.1,-1.075) 4(2.1,-1.075)
LED_0603
  rect 0.8x0.8 smd: 1(-0.851,-0.01) 2(0.75,-0.005)
M3螺丝孔
  round 5.5 hole 3.2: 1(0,0)
R0603
  rect 0.806x0.864 smd: 1(-0.753,0) 2(0.753,0)
SMB_L4.6-W3.6-LS5.3-RD
  rect 2.047x2.192 smd: 1(-2.361,0) 2(2.361,0)
SOD-123_L2.7-W1.6-LS3.7-RD
  rect 0.91x1.22 smd: 1(-1.635,0) 2(1.635,0)
SOT-23-3_L2.9-W1.3-P1.90-LS2.4-BR
  rect 1.25x0.7 smd: 1(1,-0.95) 2(1,0.95) 3(-1,0)
SOT-23-5_L3.0-W1.7-P0.95-LS2.8-BL
  rect 0.49x1.157 smd: 1(-0.95,-1.153) 2(0,-1.153) 3(0.95,-1.153)
  rect 0.49x1.175 smd: 4(0.95,1.153) 5(-0.95,1.153)
SW-TH_SS-12F44-G5
  round 1.8 hole 1.3: 1(-3,0) 2(0,0) 3(3,0)
  oval 1.5x2.5 hole 0.8x1.8: 4(5.8,0) 5(-5.8,0)
TC364_CoreBoard_V3.0
  round 1.7 hole 1.1: 1(-15.24,8.636) 2(-12.7,8.636) 3(-15.24,6.096) 4(-12.7,6.096) 5(-15.24,3.556) 6(-12.7,3.556) 7(-15.24,1.016) 8(-12.7,1.016) 9(-15.24,-1.524) 10(-12.7,-1.524) 11(-15.24,-4.064) 12(-12.7,-4.064) 13(-15.24,-6.604) 14(-12.7,-6.604) 15(-15.24,-9.144) 16(-12.7,-9.144) 17(-15.24,-11.684) 18(-12.7,-11.684) 19(-15.24,-14.224) 20(-12.7,-14.224) 21(12.7,-14.224) 22(15.24,-14.224) 23(12.7,-11.684) 24(15.24,-11.684) 25(12.7,-9.144) 26(15.24,-9.144) 27(12.7,-6.604) 28(15.24,-6.604) 29(12.7,-4.064) 30(15.24,-4.064) 31(12.7,-1.524) 32(15.24,-1.524) 33(12.7,1.016) 34(15.24,1.016) 35(12.7,3.556) 36(15.24,3.556) 37(12.7,6.096) 38(15.24,6.096) 39(12.7,8.636) 40(15.24,8.636)
TO-252-2_L6.6-W6.1-P4.57-LS9.9-TL-CW
  rect 2.8x1.3 smd: 1(-3.292,2.273) 3(-3.292,-2.273)
  rect 6.5x6 smd: 2(3.292,0)
TSOT-23-6_L2.9-W1.6-P0.95-LS2.8-BL
  rect 0.55x1.2 smd: 1(-0.95,-1.2) 2(0,-1.2) 3(0.95,-1.2) 4(0.95,1.2) 5(0,1.2) 6(-0.95,1.2)

## Nets
As in the schematic.

Pads without a net: CN12 3 4; H9 1 2; H10 1 2; H12 3 4; SW7 4 5; U16 2; U20 4; U21 1; U22 1; U23 1; U24 1; U28 7 8

## Via types
v1: diameter 0.61, hole 0.305, Top Layer to Bottom Layer, 194 vias

## Routing (per net, layer and track width the routed paths; a pad name or vN(x,y) marks a point on that pad's centre or on a via; arc(x,y) is an arc through that point)
3V3: length 165.9
  Top Layer w0.254: C11.1 39.53,26.99 39.28,27.25 25.56,27.25 v1(24.42,26.1) ; C11.1 39.05,25.03 C10.2 37.24,24.89 U20.5 ; C11.1 45.47,25.5 R14.1 58.45,25.48 61.76,22.17 66.45,22.17 R37.1 69.38,25.1 69.38,28.84 68.24,29.98 69.57,31.32 69.57,34.2 68.24,35.54 69.57,36.87 69.57,40.12 R40.1 68.3,41.47 69.57,42.74 69.57,47.5 68.87,48.2 60.47,48.2 U28.1 57.68,51 54.01,51 53.25,50.23 53.25,47.95 P1.7 ; v1(24.42,17.39) 25.31,16.51 25.31,1.08 25.97,0.43 30.62,0.43 32.04,1.85 H10.5
  Bottom Layer w0.254: v1(24.42,26.1) v1(24.42,17.39) ; H9.5 59.47,0.45 33.69,0.45 H10.5
5V: length 102.6
  Top Layer w0.254: U27.1 v1(13.12,24.39) ; 22.64,23.44 22.64,21.28 21.08,19.72 R6.2
  Top Layer w0.508: 26.91,23.44 26.91,15.87 ; 26.91,23.44 28.94,25.46 29.38,25.03 C9.2 31.41,24.89 U20.1 34.14,24.89 34.45,24.58 34.45,23.31 34.14,22.99 U20.3 ; 26.91,23.44 22.64,23.44 ; 26.91,15.87 61.68,15.87 62.9,17.09 62.9,20.13 64.04,21.28 65.95,21.28 U16.9 ; 26.91,15.87 26.91,12.18 27.59,11.5 U29.1 U29.3
  Bottom Layer w0.254: 22.64,23.44 20.99,25.09 19.59,25.09 18.9,24.39 v1(13.12,24.39)
GND:
  vias: v1(2.7,44.77) v1(3.19,45.66) v1(4.23,46.17) v1(5.24,45.66) v1(5.75,44.77) v1(7.78,43.88) v1(8.92,49.22) v1(8.92,44.66) v1(9.43,48.33) v1(9.94,43.76) v1(10.45,47.82) v1(11.08,44.66) v1(11.44,48.33) v1(11.85,49.22) v1(12.1,43.76) v1(12.35,16.2) v1(12.86,17.09) v1(12.86,15.18) v1(13.75,17.47) v1(13.75,14.8) v1(14,49.85) v1(15.39,48.66) v1(15.66,42.61) v1(15.66,41.62) v1(15.66,40.57) v1(16.54,49.72) v1(16.8,26.74) v1(16.94,42.62) v1(16.94,41.62) v1(16.94,40.57) v1(17.18,23.44) v1(17.18,21.53) v1(17.56,19.75) v1(18.09,22.42) v1(18.13,20.65) v1(18.29,28.12) v1(18.7,23.44) v1(19.21,22.55) v1(19.55,29.23) v1(19.55,26.8) v1(19.46,18.57) v1(19.97,22.04) v1(20.74,22.42) v1(22.8,18.57) v1(27.85,22.04) v1(27.85,20.78) v1(28.61,44.43) v1(28.99,20.77) v1(30.13,22.04) v1(30.14,20.77) v1(30.2,23.64) v1(30.9,48.71) v1(30.9,47.1) v1(30.9,44.97) v1(31.28,22.67) v1(32.29,23.82) v1(32.8,42.99) v1(34.96,42.87) v1(35.17,36.01) v1(35.78,44.77) v1(36.36,23.94) v1(36.87,44.77) v1(37.37,22.72) v1(37.75,36.01) v1(38.34,23.94) v1(38.27,22.14) v1(38.26,20.77) v1(39.02,31.56) v1(39.53,20.77) v1(40.29,36.01) v1(40.55,29.79) v1(40.73,22.13) v1(40.75,20.77) v1(41.82,31.18) v1(41.94,44.52) v1(42.89,36.01) v1(43.2,29.79) v1(44.49,44.77) v1(44.48,31.18) v1(45.37,36.01) v1(45.75,32.71) v1(45.88,29.79) v1(46.9,33.85) v1(47.48,31.18) v1(47.91,38.04) v1(48.04,35.12) v1(48.55,32.33) v1(48.46,29.79) v1(48.93,47.95) v1(48.93,36.39) v1(49.95,30.8) v1(50.45,38.04) v1(50.71,34.87) v1(50.71,32.33) v1(50.84,36.39) v1(50.84,29.81) v1(51.61,47.95) v1(51.72,30.8) v1(52.52,32.33) v1(52.76,29.81) v1(52.87,36.39) v1(53.01,38.04) v1(53.54,30.8) v1(53.88,34.87) v1(54.26,47.95) v1(54.48,32.33) v1(54.66,29.81) v1(54.94,36.39) v1(55.41,38.04) v1(55.66,30.8) v1(56.04,34.87) v1(56.65,32.33) v1(56.84,29.81) v1(56.99,36.39) v1(57.69,30.8) v1(58.06,38.04) v1(58.19,34.87) v1(58.66,32.33) v1(58.82,29.81) v1(59.1,36.39) v1(59.66,30.8) v1(60.04,34.87) v1(60.4,38.04) v1(60.65,32.33) v1(60.84,36.39) v1(60.96,29.81) v1(61.38,41.12) v1(61.38,38.93) v1(61.63,30.8) v1(61.7,34.87) v1(62.44,36.39) v1(62.39,28.64) v1(62.73,32.33) v1(63.03,42.99) v1(63.28,30.8) v1(64.17,40.2) v1(64.23,34.49) v1(64.17,28.52) v1(64.3,36.01)
VCCBAT:
  vias: v1(3.91,40.96) v1(4.8,40.96) v1(5.73,40.96) v1(6.51,40.96) v1(6.64,24.45) v1(6.64,23.44) v1(6.64,22.42) v1(6.64,21.4) v1(6.64,20.39) v1(6.64,19.37) v1(7.27,40.96) v1(7.66,24.45) v1(7.66,23.44) v1(7.66,22.42) v1(7.66,21.4) v1(7.66,20.39) v1(7.66,19.37) v1(8.09,40.96) v1(8.67,24.45) v1(8.67,23.44) v1(8.67,22.42) v1(8.67,21.4) v1(8.67,20.39) v1(8.67,19.37) v1(8.94,40.96) v1(9.72,40.96) v1(9.69,24.45) v1(9.69,23.44) v1(9.69,22.42) v1(9.69,21.4) v1(9.69,20.39) v1(9.69,19.37) v1(10.49,40.96) v1(10.7,24.45) v1(10.7,23.44) v1(10.7,22.42) v1(10.7,21.4) v1(10.7,20.39) v1(10.7,19.37) v1(11.27,40.96) v1(11.72,24.45) v1(11.72,23.44) v1(11.72,22.42) v1(11.72,21.4) v1(11.72,20.39) v1(11.72,19.37)
VCCSTEER: length 10
  Top Layer w0.254: R47.2 v1(23.78,49.47)
VIN: length 22.6
  Top Layer w0.254: Q1.3 2.57,21.16 0.67,23.06 0.67,33.29 SW7.3 3.5,36.12 D3.1
00.9: length 18.9
  Top Layer w0.254: U29.5 41.56,9.85 39.53,7.81 31.78,7.81 30.77,6.8 30.77,3.37 H10.3
02.8: length 19.2
  Top Layer w0.254: H10.4 29.5,7.56 31.02,9.09 39.28,9.09 40.17,9.97 40.17,12.64 U29.6
11.6: length 16
  Top Layer w0.254: H12.5 33.69,49.98 33.69,44.77 34.32,44.14 39.41,44.14 U29.36
11.9: length 7
  Top Layer w0.254: 39.06,37.58 39.06,39.4 U29.37
  Bottom Layer w0.254: U29.37 39.04,39.42 v1(39.04,34.31)
11.10: length 11.8
  Top Layer w0.254: U29.38 37.5,43.5 33.44,43.5 32.42,44.52 H12.6
11.11: length 7
  Top Layer w0.254: 36.5,37.57 36.5,39.42 U29.39
  Bottom Layer w0.254: U29.39 36.5,39.42 v1(36.5,34.3)
11.12: length 17.1
  Top Layer w0.254: R13.1 30.01,52 30.01,44.39 32.42,41.98 U29.40
13.0: length 7
  Top Layer w0.254: U29.33 44.12,39.42 44.12,37.61
  Bottom Layer w0.254: v1(44.1,34.3) U29.33
13.2: length 7
  Top Layer w0.254: 41.56,37.58 U29.35
  Bottom Layer w0.254: v1(41.56,34.3) U29.35
15.0: length 13.9
  Top Layer w0.254: P1.3 43.6,44.14 46.64,44.14 47.79,42.99 47.79,41.6 48.68,40.71 50.45,40.71 U29.27
15.1: length 9.5
  Top Layer w0.254: U29.28 50.33,43.38 48.42,43.38 47.15,44.64 45.63,44.64 P1.4
15.2: length 13.9
  Top Layer w0.254: U29.29 47.91,40.71 46.14,40.71 45.25,41.6 45.25,42.87 44.49,43.63 41.56,43.63 38.9,46.3
15.3: length 4.4
  Bottom Layer w0.254: U29.30 49.18,46.17 49.06,46.3
15.4: length 13.9
  Top Layer w0.254: U29.31 45.37,40.71 43.34,40.71 42.83,41.22 42.83,42.49 42.07,43.25 41.31,43.25 39.79,44.77 37.88,44.77 36.36,46.3
15.5: length 4.4
  Bottom Layer w0.254: U29.32 46.52,42.11 46.52,46.3
15.8: length 12.1
  Bottom Layer w0.254: U16.6 62.65,14.55 60.74,12.64 55.41,12.64 U29.15
20.11: length 12.4
  Top Layer w0.254: U29.23 58.07,40.71 58.07,42.99 57.31,43.76 56.68,43.76 55.53,44.9 55.53,48.14 U28.3
20.12: length 12.2
  Top Layer w0.254: U29.24 55.28,43.5 53.5,43.5 51.98,45.03 50.84,45.03 50.33,45.53 50.33,48.35 U28.5
20.13: length 14.5
  Top Layer w0.254: U29.25 52.99,40.71 52.99,42.99 51.47,44.52 48.8,44.52 47.79,45.53 47.79,48.39 U28.6
20.14: length 8.4
  Bottom Layer w0.254: U29.26 52.87,43.38 52.87,48.31 U28.4
22.0: length 17.1
  Bottom Layer w0.254: U29.17 59.98,8.32 65.57,8.32 66.33,9.09 66.33,13.28 U16.5
22.1: length 14.2
  Top Layer w0.254: U16.1 66.33,10.74 61.12,10.74 60.61,10.23 58.71,10.23 57.95,10.99 57.95,12.89 U29.18
22.2: length 5.9
  Top Layer w0.254: U29.19 59.85,12.01 U16.4
22.3: length 9.1
  Top Layer w0.254: U29.20 60.23,13.15 66.46,13.15 U16.3
23.1: length 15.6
  Bottom Layer w0.254: U29.16 54.26,18.36 55.53,19.63 U16.10
33.0: length 13.9
  Top Layer w0.254: U29.7 44.1,8.58 41.44,5.91 38.64,5.91 38.13,5.4 38.13,2.91 37.32,2.09
33.1: length 13.6
  Top Layer w0.254: R9.1 37.38,6.05 38.13,6.8 40.55,6.8 42.83,9.09 42.83,12.77 U29.8
33.3: length 7.5
  Top Layer w0.254: R15.1 49.18,19.36 v1(49.18,17.59) R16.1
  Bottom Layer w0.254: U29.10 46.64,16.96 47.28,17.59 v1(49.18,17.59)
33.4: length 10.3
  Top Layer w0.254: U29.11 49.18,8.7 50.58,7.31 50.58,2.78 R12.2
33.5: length 10.3
  Top Layer w0.254: R10.2 51.33,8.2 50.45,9.09 50.45,12.77 U29.12
33.6: length 14.1
  Top Layer w0.254: U29.13 51.72,9.72 53.38,8.07 56.55,8.07 57.31,7.31 57.31,3.37 H9.3
33.7: length 14.1
  Top Layer w0.254: U29.14 52.99,12.77 52.99,10.23 54.01,9.21 57.19,9.21 58.58,7.81 H9.4
$1N756: length 10
  Top Layer w0.254: Q1.1 2.57,25.6 1.43,26.74 1.43,31.06 SW7.2
$1N757: length 7.3
  Top Layer w0.254: D3.2 R1.1 3.39,29.9 SW7.1
$1N1651: length 1.6
  Top Layer w0.254: R6.1 21.04,15.83 LED1.2
$1N1936: length 1.7
  Top Layer w0.254: LED4.2 24.38,15.83 R8.1
$1N2039: length 2.5
  Top Layer w0.254: R13.2 28.6,51.88 H1.1
$1N2442: length 6.4
  Top Layer w0.254: BUZZER3.1 50.87,26.98 R14.2
$1N2446: length 5.5
  Top Layer w0.254: BUZZER3.2 54.63,19.68 Q2.3
$1N2966: length 2.9
  Top Layer w0.254: H4.2 R9.2
$1N2968: length 2.9
  Top Layer w0.254: H4.6 R10.1
$1N2969: length 3
  Top Layer w0.254: H4.1 38.83,2.1 R11.2
$1N2971: length 2.9
  Top Layer w0.254: R12.1 49.76,2.1 H4.5
$1N3489: length 2.4
  Top Layer w0.254: SW8.1 68.31,25.54 R37.2
$1N3490: length 2.3
  Top Layer w0.254: SW9.1 68.25,31.5 R38.2
$1N3491: length 2.3
  Top Layer w0.254: R39.2 66.87,35.54 SW10.1
$1N3492: length 2.4
  Top Layer w0.254: SW11.1 68.31,43.06 R40.2
$1N3494: length 26.6
  Top Layer w0.254: R42.1 41.36,30.42 48.04,30.42 49.06,31.44 64.16,31.44 SW9.2
$1N3495: length 25.2
  Top Layer w0.254: SW10.2 62.76,35.63 50.33,35.63 46.52,31.82 42.51,31.82 R43.1
$1N3496: length 25.8
  Top Layer w0.254: SW11.2 62.14,40.97 62.14,38.55 60.74,37.15 48.5,37.15 R44.1
$1N3497: length 30.7
  Top Layer w0.254: SW8.2 60.61,29.15 40.11,29.15 R41.1
$1N3677: length 2
  Top Layer w0.254: R15.2 52.57,19.37 Q2.1
$1N6375: length 2.3
  Top Layer w0.254: 13.4,39.73 11.39,39.73 R45.2
$1N6376: length 2
  Top Layer w0.254: C30.2 13.4,45.5 13.4,43.55
$1N6377: length 5.6
  Top Layer w0.254: L4.1 19.8,45.53 C30.1
$1N6378: length 3.3
  Top Layer w0.254: U26.5 19.22,38.06 R49.2 20.66,38.01 R48.1
$1N6381: length 1.7
  Top Layer w0.254: R50.1 28.61,47.18 LED5.2
$1N6382: length 2.1
  Top Layer w0.254: U26.6 21.21,41 R46.2
$1N6384: length 1.7
  Top Layer w0.254: C32.2 22.76,42.56 R46.1
$1N6385: length 1.6
  Top Layer w0.254: R48.2 23.73,37.97 R47.1
$1N16880: length 2.5
  Top Layer w0.254: C42.2 13.31,27.82 13.94,27.18 U27.6

## Copper pours and planes (outline as drawn; the poured copper is in the pictures)
5V on Top Layer: 19.59,32.07 19.47,31.94 19.47,29.91 19.59,29.79 20.61,29.79 20.86,29.53 20.86,25.01 21.37,24.51 21.37,22.67 21.5,22.55 23.28,22.55 23.53,22.8 23.53,31.82 23.28,32.07
GND on Top Layer: 0.03,55.06 70.01,55.06 70.01,-0.06 0.03,-0.06
GND on Bottom Layer: 0.03,55.06 70.01,55.06 70.01,-0.06 0.03,-0.06
VCCBAT on Top Layer: 5.88,25.09 5.75,24.96 5.75,18.86 5.88,18.74 14.12,18.74 15.02,17.83 15.02,10.99 15.78,10.23 18.7,10.23 19.21,10.74 19.21,12.39 17.94,13.66 17.94,18.23 16.42,19.75 16.42,25.01 16.25,25.18 14.6,25.18 14.51,25.09 14.51,23.69 14.26,23.44 13,23.44 12.67,23.76 12.67,24.9 12.48,25.09
VCCBAT on Top Layer: 3.59,43.12 7.66,43.12 7.91,42.87 14.03,42.87 14.26,42.63 14.26,40.71 14,40.45 3.59,40.45 3.08,40.96 3.08,42.61
VCCBAT on Bottom Layer: 6.13,18.86 6.13,40.33 5.88,40.58 3.72,40.58 3.21,41.09 3.21,42.49 3.72,42.99 11.58,42.99 11.99,42.59 11.99,40.97 11.21,40.19 11.21,26.1 12.35,24.96 12.35,19.12 11.97,18.74 6.26,18.74
VCCSTEER on Top Layer: 23.77,53.28 24.97,52.08 24.97,50.45 25.05,50.36 27.85,50.36 27.97,50.49 27.97,50.87 28.1,51 29.12,51 29.25,50.87 29.25,49.98 29.12,49.85 27.3,49.85 27.04,49.6 27.04,48.79 26.71,48.45 24.04,48.45 23.53,48.97 23.53,49.98 22.9,50.61 16.91,50.61 16.64,50.88 9.67,50.88 9.43,51.12 9.43,53.03 9.69,53.28
VIN on Top Layer: 0,20.44 5.24,20.44 5.24,13.15 0,13.15
$1N6377 on Top Layer: 18.36,43.25 18.62,42.99 19.85,42.99 19.85,44.52 19.97,44.64 21.88,44.64 22.01,44.77 22.01,47.19 21.88,47.31 18.58,47.31 18.45,47.19 18.45,43.25
$1N16876 on Top Layer: 14.51,26.23 15.28,26.23 15.28,28.01 15.53,28.26 16.54,28.26 16.67,28.39 16.67,30.8 16.54,30.93 10.96,30.93 10.07,30.04 10.07,27.45 10.32,27.2 11.18,27.2 11.4,27.42 11.4,28.25 11.68,28.53 12.98,28.53 13.24,28.26 14.26,28.26 14.51,28.01
$1N18849 on Top Layer: 13.12,34.36 13.24,34.23 16.54,34.23 16.67,34.36 21.88,34.36 22.01,34.48 22.01,36.77 21.88,36.9 13.24,36.9 13.12,36.77

Small or netless copper shapes (teardrops, artwork), in the pictures only: 159 on Top Layer, 28 on Bottom Layer

## Text on the board
Bottom Silkscreen Layer: 后车MAINBOARD_V2.1
Top Layer: Origin | 2025/4/15 | 华东理工大学 20th
Top Solder Mask Layer: Origin | 2025/4/15 | 华东理工大学 20th
Top Silkscreen Layer: 5V | 3V3 | STEER | ENCODER | BLDC | MOTOR | TFTLCD | IMU660 | WIFISPI | OFF | ON
